# EAGLE design Analog-RGB-Mixer (EAGLE 7.2.0)
Analoger Farbmischer mit PNP Transistoren
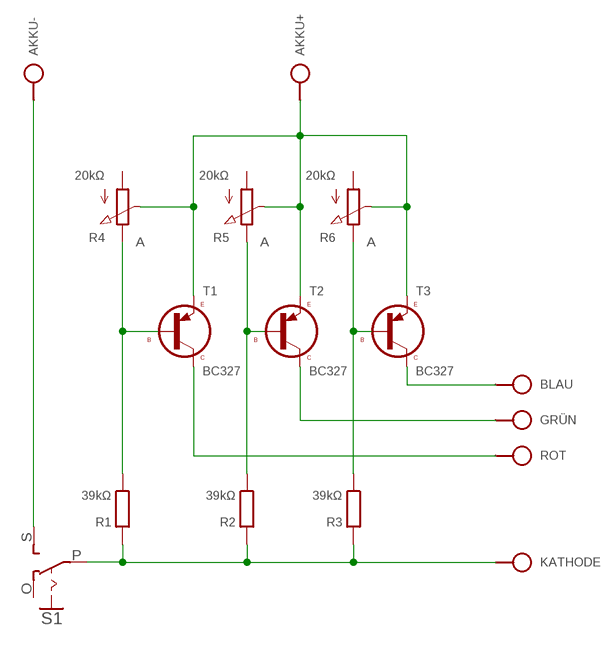
[diagram p0: schematic, sheet 1]

## Parts
AKKU  SPAD+--+  [SPAD-+]
BLAU  HPORT  [SPAD]
GRÜN  HPORT  [SPAD]
KATHODE  HPORT  [SPAD]
R1  39kΩ  R0204/5  [0204/5]
R2  39kΩ  R0204/12-V  [0204/12-V]
R3  39kΩ  R0204/20-V  [0204/20-V]
R4  20kΩ  POT2A-2P  [CONN-2P]
R5  20kΩ  POT2A-2P  [CONN-2P]
R6  20kΩ  POT2A-2P  [CONN-2P]
ROT  HPORT  [SPAD]
S1  SL-SW-1P-2T-H  [SLSW-1P2T-H]
T1  BC327  [TO92]
T2  BC327  [TO92]
T3  BC327  [TO92]

## Nets
N$1: R1.2 R4.1(A) T1.2(B)
N$2: R2.2 R5.1(A) T2.2(B)
N$3: R3.1 R6.1(A) T3.2(B)
N$4: KATHODE.1 R1.1 R2.1 R3.2 S1.P
N$5: AKKU.1 S1.S
N$7: AKKU.2 R4.2(S) R5.2(S) R6.2(S) T1.3(E) T2.3(E) T3.3(E)
N$8: BLAU.1 T3.1(C)
N$9: ROT.1 T1.1(C)
N$10: GRÜN.1 T2.1(C)
Unconnected: S1.O

## Library data of the parts
AKKU = pad:SPAD+-
BLAU GRÜN KATHODE ROT = pad:HPORT
R1-R3 = r:R: RESISTOR, European symbol
R4-R6 = r:POT2A
S1 = sw:SL-SW-1P-2T
T1-T3 = t:BC327

## Board
Analoger Farbmischer mit PNP Transistoren
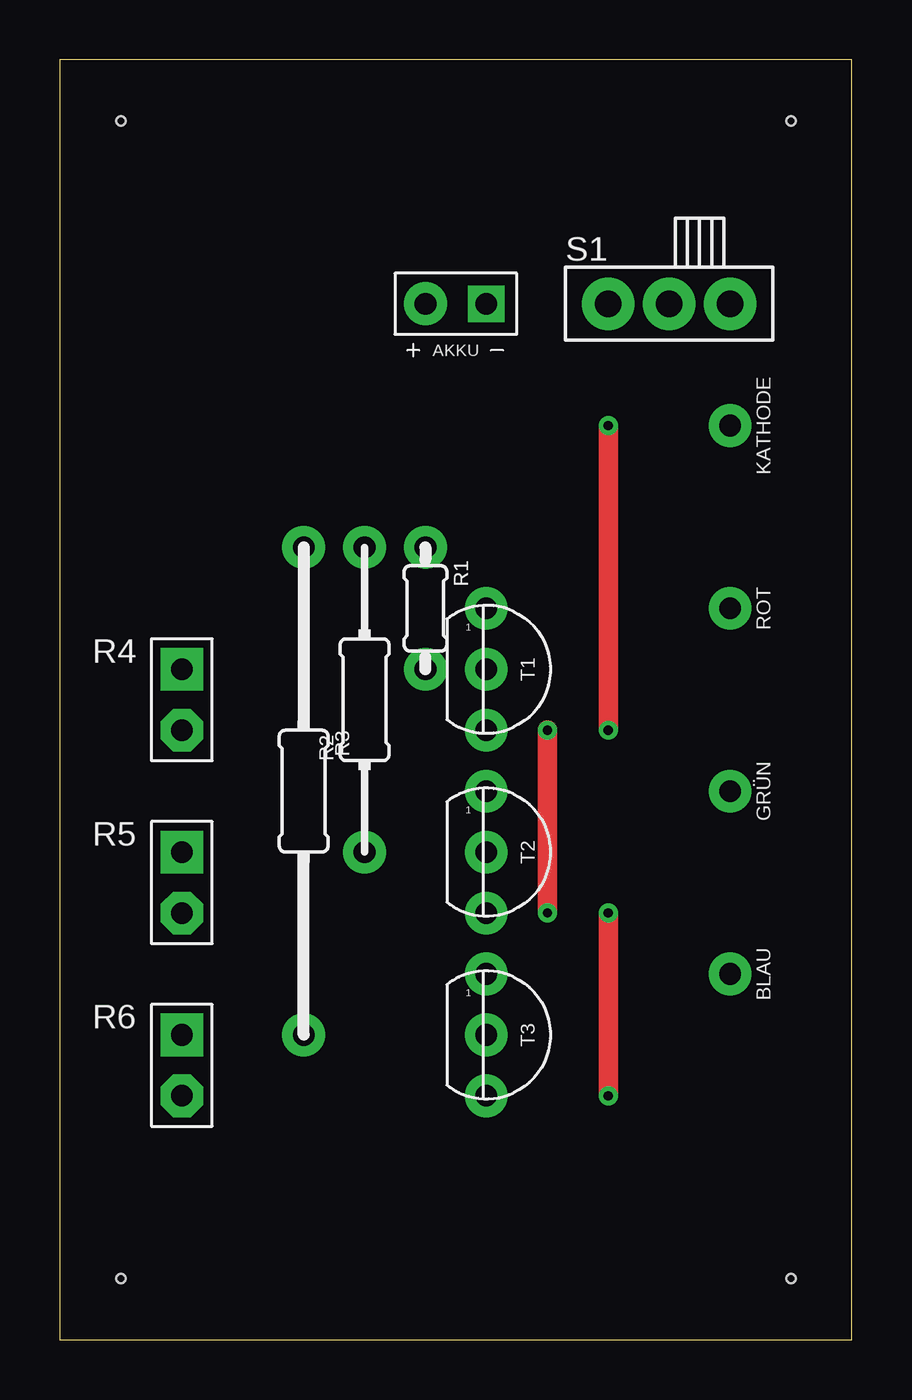
[diagram p1: board, top side]
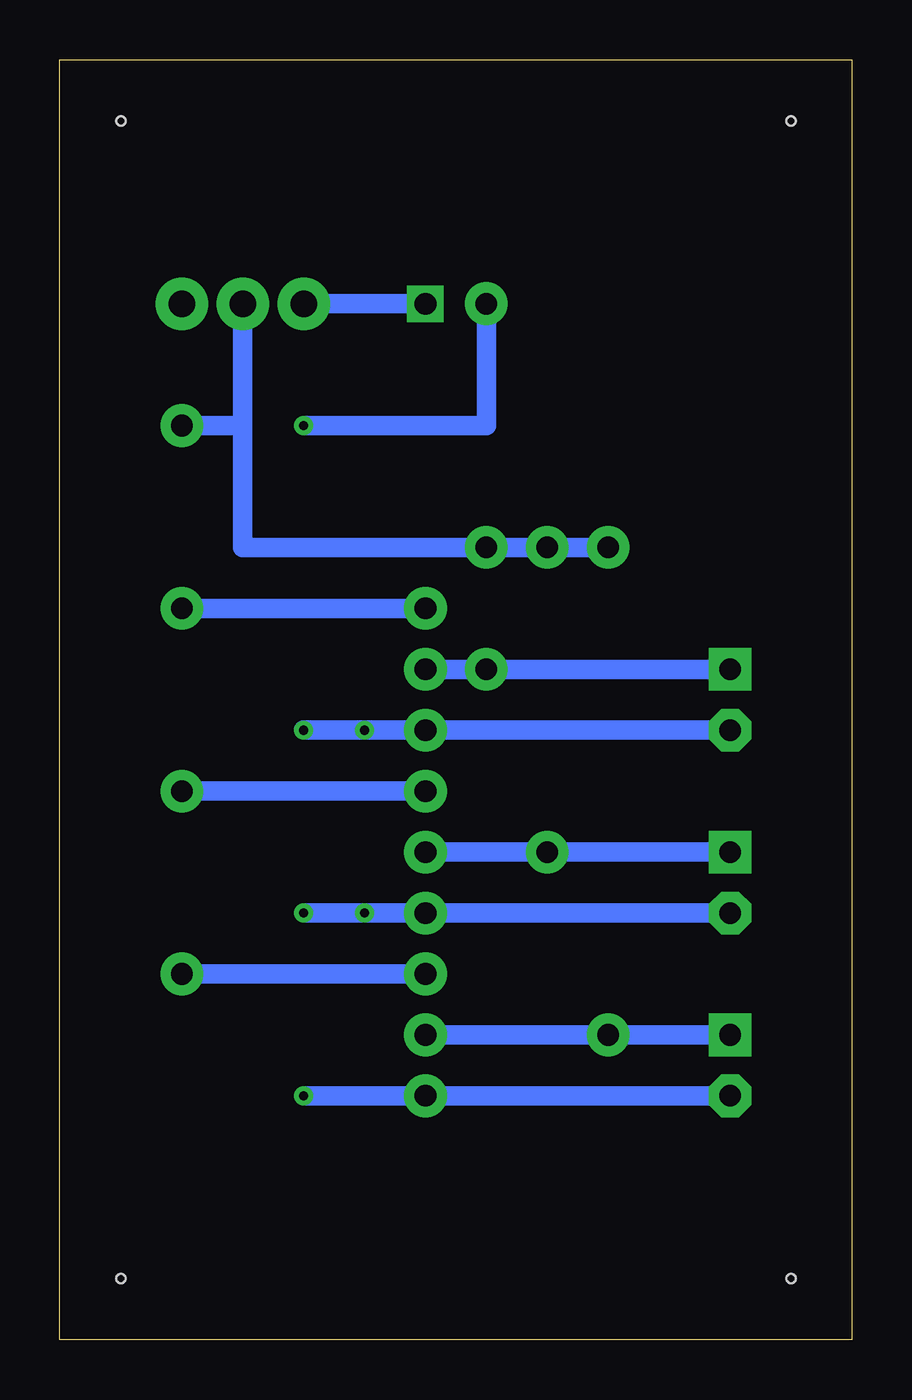
[diagram p2: board, bottom side, seen from below]

Size 33.02 x 53.34 mm. Coordinates in mm from the lower left corner, seen from the top.
Outline: 0,0 33.02,0 33.02,53.34 0,53.34 0,0
Copper layers (1*16): Top 0.035mm / dielectric 1.5mm / Bottom 0.035mm
Design rules "default": minimum track width 10mil, minimum drill 24mil, track to track 8mil, track to pad 8mil, pad to pad 8mil, via to via 8mil, smd to smd 8mil, copper to edge 40mil, drill to drill 8mil, minimum pad ring 10mil, minimum via ring 8mil, stop-mask expansion 4mil, vias tented up to drill 0mil, thermal gap 10mil
Holes 0.38 mm at 2.54,2.54 30.48,2.54 2.54,50.8 30.48,50.8

### Footprints (pad centres in the part's own frame; a part is rotated, then mirrored left to right if it is on the bottom)
SPAD-+ = drill 0.9 pad 1.524 square: 1 0,-1.27 | drill 0.9 pad 1.778: 2 0,1.27
SPAD = drill 0.9 pad 1.778: 1 0,0
0204/5 = drill 0.9 pad 1.778: 1 -2.54,0; 2 2.54,0
0204/12-V = drill 0.9 pad 1.778: 1 0,6.35; 2 0,-6.35
0204/20-V = drill 0.9 pad 1.778: 1 0,10.16; 2 0,-10.16
CONN-2P = drill 0.9 pad 1.778 square: 1 0,-1.27 | drill 0.9 pad 1.778 octagon: 2 0,1.27
SLSW-1P2T-H = drill 1.1 pad 2.184: O 2.54,0; P 0,0; S -2.54,0
TO92 = drill 0.9 pad 1.778: 1 0,2.54; 2 0,0; 3 0,-2.54

### Placement (x,y rotation side)
AKKU  16.51,43.18 90 top
BLAU  27.94,15.24 180 top
GRÜN  27.94,22.86 180 top
KATHODE  27.94,38.1 180 top
R1  15.24,30.48 270 top
R2  12.7,26.67 0 top
R3  10.16,22.86 180 top
R4  5.08,26.67 180 top
R5  5.08,19.05 180 top
R6  5.08,11.43 180 top
ROT  27.94,30.48 180 top
S1  25.4,43.18 0 top
T1  17.78,27.94 0 top
T2  17.78,20.32 0 top
T3  17.78,12.7 0 top

### Tracks (layer width: path | path; a pad name or v marks a point on that pad's centre or on a via)
N$1
  Bottom 0.813: R4.1 R1.2 T1.2
N$2
  Bottom 0.813: R5.1 R2.2 T2.2
N$3
  Bottom 0.813: T3.2 R3.1 R6.1
N$4
  Bottom 0.813: KATHODE.1 25.4,38.1 | S1.P 25.4,38.1 | 25.4,38.1 25.4,33.02 R1.1 R2.1 R3.2
N$5
  Bottom 0.813: S1.S AKKU.1
N$7  (via drill 0.38)
  Top 0.813: v20.32,25.4 v20.32,17.78 | v22.86,17.78 v22.86,10.16 | v22.86,25.4 v22.86,38.1
  Bottom 0.813: v20.32,25.4 T1.3 R4.2 v22.86,25.4 | v22.86,17.78 v20.32,17.78 T2.3 R5.2 | v22.86,38.1 15.24,38.1 AKKU.2 | v22.86,10.16 T3.3 R6.2 v22.86,10.16
N$8
  Bottom 0.813: T3.1 BLAU.1
N$9
  Bottom 0.813: T1.1 ROT.1
N$10
  Bottom 0.813: T2.1 GRÜN.1